# EAGLE schematic fCPU.Controller1 (EAGLE 7.6.0)
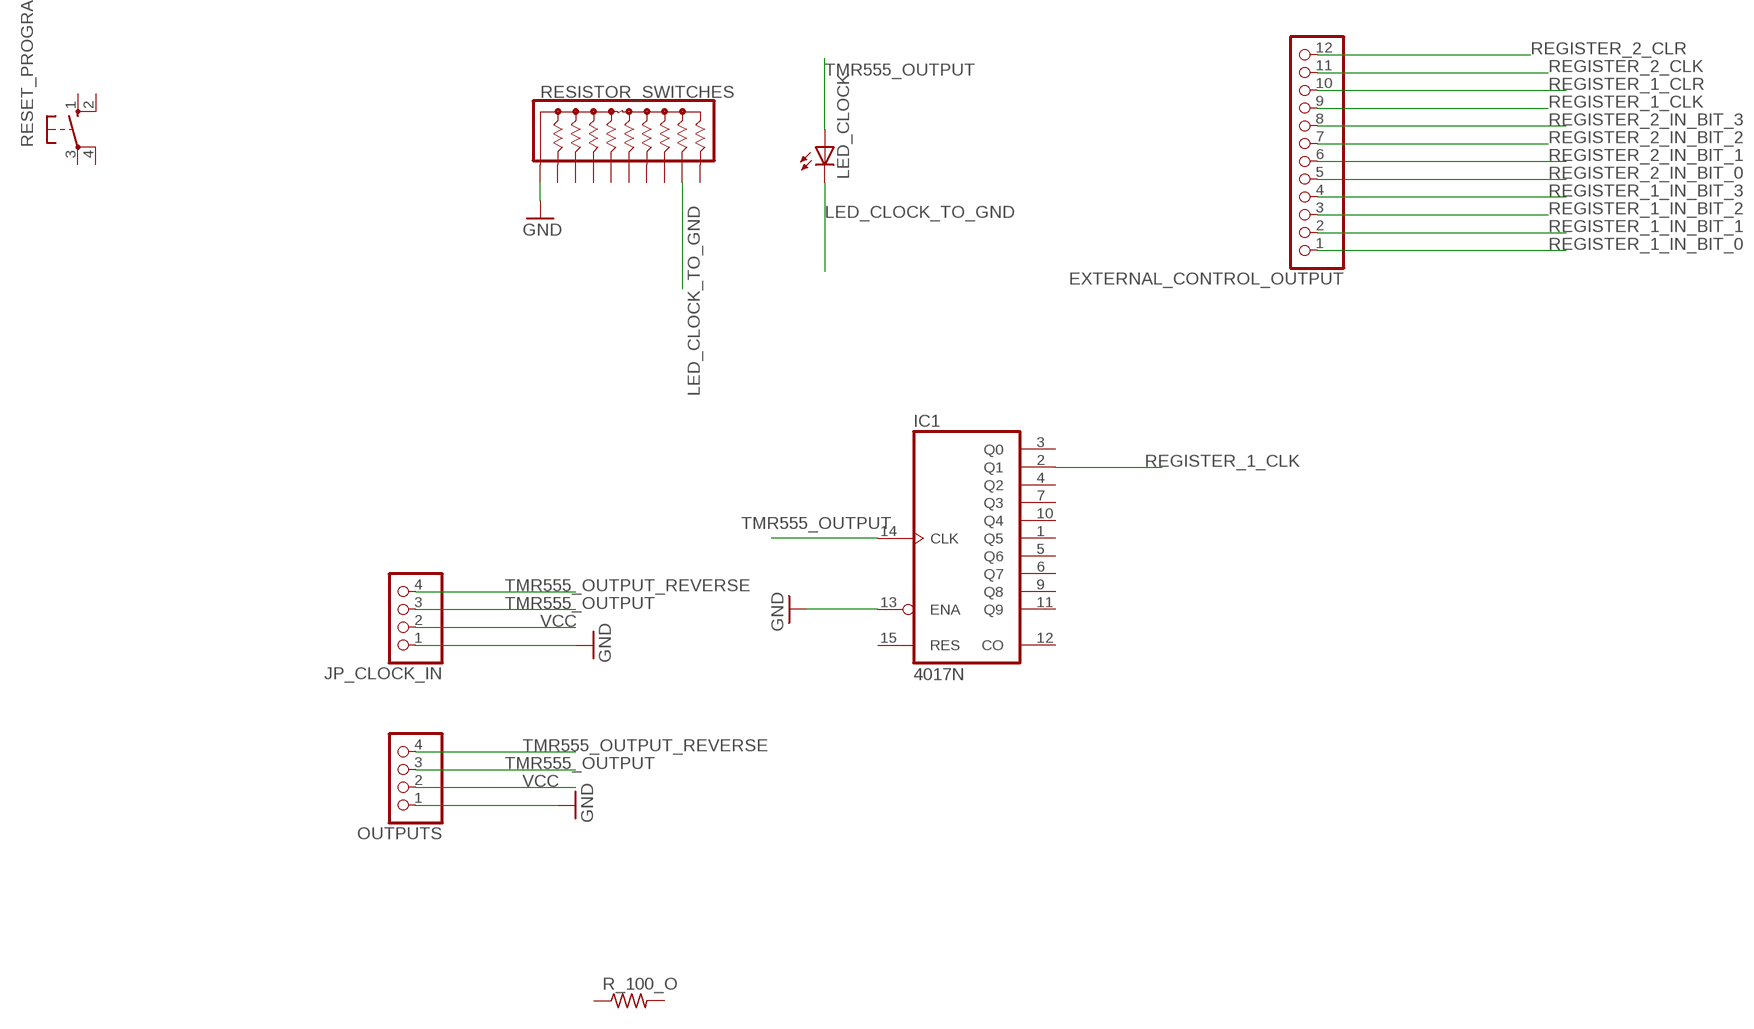
[diagram p0: schematic, sheet 1]

## Parts
EXTERNAL_CONTROL_OUTPUT  PINHD-1X12  [1X12]
IC1  4017N  [DIL16]
JP_CLOCK_IN  PINHD-1X4  [1X04]
LED_CLOCK  LEDSMT1206  [1206]
OUTPUTS  PINHD-1X4  [1X04]
R_100_O  R-US_R1206  [R1206]
RESET_PROGRAM  10-XX  [B3F-10XX]
RESISTOR_SWITCHES  4610X  [SIP10]

## Nets
GND: IC1.13(ENA) JP_CLOCK_IN.1 OUTPUTS.1 RESISTOR_SWITCHES.1
LED_CLOCK_TO_GND: LED_CLOCK.C RESISTOR_SWITCHES.9
REGISTER_1_CLK: EXTERNAL_CONTROL_OUTPUT.9 IC1.2(Q1)
REGISTER_1_CLR: EXTERNAL_CONTROL_OUTPUT.10
REGISTER_1_IN_BIT_0: EXTERNAL_CONTROL_OUTPUT.1
REGISTER_1_IN_BIT_1: EXTERNAL_CONTROL_OUTPUT.2
REGISTER_1_IN_BIT_2: EXTERNAL_CONTROL_OUTPUT.3
REGISTER_1_IN_BIT_3: EXTERNAL_CONTROL_OUTPUT.4
REGISTER_2_CLK: EXTERNAL_CONTROL_OUTPUT.11
REGISTER_2_CLR: EXTERNAL_CONTROL_OUTPUT.12
REGISTER_2_IN_BIT_0: EXTERNAL_CONTROL_OUTPUT.5
REGISTER_2_IN_BIT_1: EXTERNAL_CONTROL_OUTPUT.6
REGISTER_2_IN_BIT_2: EXTERNAL_CONTROL_OUTPUT.7
REGISTER_2_IN_BIT_3: EXTERNAL_CONTROL_OUTPUT.8
TMR555_OUTPUT: IC1.14(CLK) JP_CLOCK_IN.3 LED_CLOCK.A OUTPUTS.3
TMR555_OUTPUT_REVERSE: JP_CLOCK_IN.4 OUTPUTS.4
VCC: JP_CLOCK_IN.2 OUTPUTS.2
Unconnected: IC1.1(Q5) IC1.3(Q0) IC1.4(Q2) IC1.5(Q6) IC1.6(Q7) IC1.7(Q3) IC1.9(Q8) IC1.10(Q4) IC1.11(Q9) IC1.12(CO) IC1.15(RES) R_100_O.1 R_100_O.2 RESET_PROGRAM.1(S) RESET_PROGRAM.2(S1) RESET_PROGRAM.3(P) RESET_PROGRAM.4(P1) RESISTOR_SWITCHES.2 RESISTOR_SWITCHES.3 RESISTOR_SWITCHES.4 RESISTOR_SWITCHES.5 RESISTOR_SWITCHES.6 RESISTOR_SWITCHES.7 RESISTOR_SWITCHES.8 RESISTOR_SWITCHES.10

## Power pins joined to a net without a drawn wire
VDD: IC1.16(VDD)
VSS: IC1.8(VSS)

## Library data of the parts
EXTERNAL_CONTROL_OUTPUT = adafruit:PINHD-1X12: PIN HEADER
IC1 = 40xx:4017: COUNTER/DIVIDER
JP_CLOCK_IN OUTPUTS = pinhead:PINHD-1X4: PIN HEADER
LED_CLOCK = adafruit:LED: LED OSRAM: - CHIPLED LG R971, LG N971, LY N971, LG Q971, LY Q971, LO R971, LY R971 LH N974, LH R974 LS Q976, LO Q976, LY Q976 LO Q996 - Hyper CHIPLED LW Q18S LB Q993, LB Q99A, LB R99A - SideLED LS A670, LO A670, LY A670, LG A670, LP A670 LB A673, LV A673, LT A673, LW A673 LH A674 LY A675 LS A676, LA A676, LO A676, LY A676, LW A676 LS A679, LY A679, LG A679 - Hyper Micro SIDELED® LS Y876, LA Y876, LO Y876, LY Y876 LT Y87S - SmartLED LW L88C, LW L88S LB L89C, LB L89S, LG L890 LS L89K, LO L89K, LY L89K LS L896, LA L896, LO L896, LY L896 - TOPLED LS T670, LO T670, LY T670, LG T670, LP T670 LSG T670, LSP T670, LSY T670, LOP T670, LYG T670 LG T671, LOG T671, LSG T671 LB T673, LV T673, LT T673, LW T673 LH T674 LS T676, LA T676, LO T676, LY T676, LB T676, LH T676, LSB T676, LW T676 LB T67C, LV T67C, LT T67C, LS T67K, LO T67K, LY T67K, LW E67C LS E67B, LA E67B, LO E67B, LY E67B, LB E67C, LV E67C, LT E67C LW T67C LS T679, LY T679, LG T679 LS T770, LO T770, LY T770, LG T770, LP T770 LB T773, LV T773, LT T773, LW T773 LH T774 LS E675, LA E675, LY E675, LS T675 LS T776, LA T776, LO T776, LY T776, LB T776 LHGB T686 LT T68C, LB T68C - Hyper Mini TOPLED® LB M676 - Mini TOPLED Santana® LG M470 LS M47K, LO M47K, LY M47K Source: http://www.osram.convergy.de/
R_100_O = adafruit:R-US_: RESISTOR, American symbol
RESET_PROGRAM = switch-omron:10-XX: OMRON SWITCH; MPN: B3F-1000; OC_FARNELL: 176432; OC_NEWARK: 36M3542
RESISTOR_SWITCHES = resistor-sip:4610X: Bourns 4600X Series - Thick Film Conformal SIPs 4610X-101 Resistor Network Configuration: 101 (Bussed Resistors) Resistance range: 10 ohms to 10 Megaohms Maximum Operating Voltage: 100V Source: http://www.bourns.com/ProductLine.aspx?name=standard_thick_film_networks PDF: http://www.bourns.com/data/global/pdfs/4600X.pdf